# Altium schematic sheet PROC106B_ANALOG_MUX.SchDoc: BREAKAWAY_SECTION4
size 431 x 279 mm; Date: Not shown in title block; ApprovedBy: Not shown in title block; CheckedBy: Not shown in title block; Author: Not shown in title block; CompanyName: Not shown in title block; DrawnBy: Antony/Anand Ram; Engineer: Not shown in title block; Organization: Not shown in title block; Address1: Not shown in title block; Address2: Not shown in title block; Address3: Not shown in title block; Address4: Not shown in title block; DocumentNumber: 10; Revision: Use project parameter SCH_Rev; SheetNumber: 10; SheetTotal: 12; PageSetup: Record=PageOptions|CenterHorizontal=True|CenterVertical=True|PrintScale=1.00|XCorrection=1.00|YCorrection=1.00|PrintKind=0|BorderSize=5000000|LeftOffset=0|BottomOffset=0|Orientation=2|PaperLength=1000|PaperWidth=1000|Scale=100|PaperSource=15|PrintQuality=600|MediaType=1|DitherType=10|PaperKind=Letter|PrintScaleMode=1; CurrentTime: Not shown in title block; CurrentDate: Not shown in title block; Time: Not shown in title block; DocumentFullPathAndName: Not shown in title block; DocumentName: Not shown in title block; ModifiedDate: Not shown in title block; ImagePath: Not shown in title block
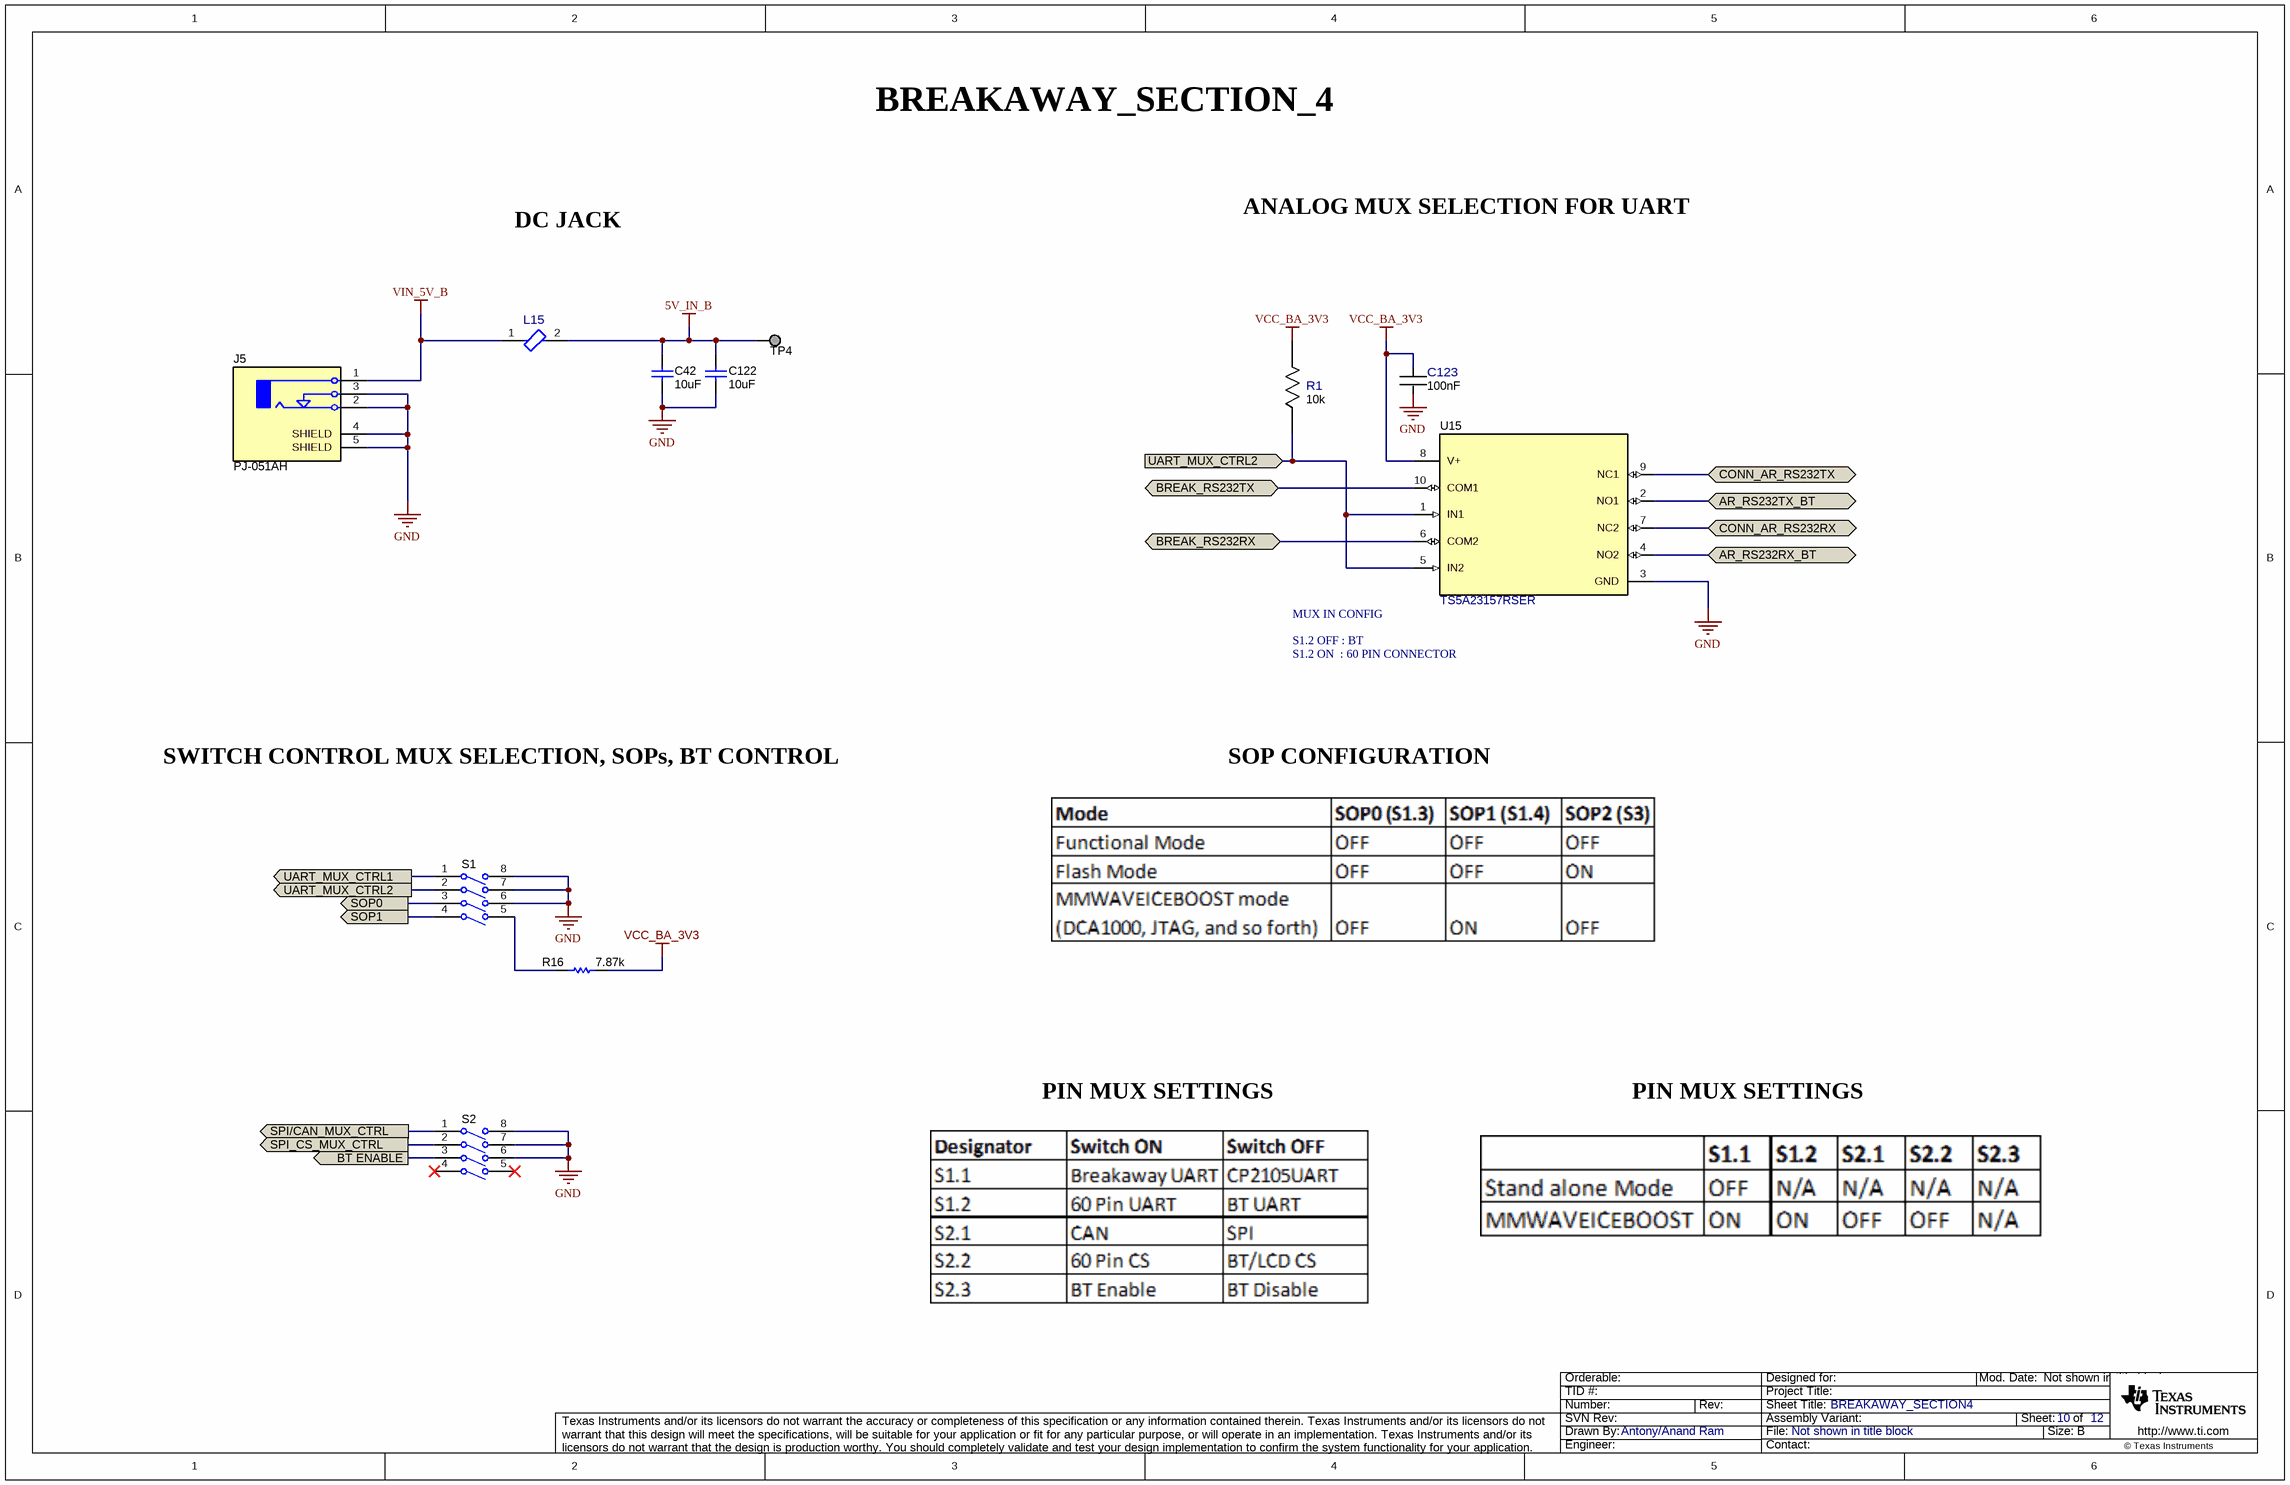
[diagram p0: PROC106B_ANALOG_MUX.SchDoc]

## Parts
C42  value 10uF  [0402_070]  (hidden comment: CL05A106MP5NUNC)
C122  value 10uF  [0402_070]  (hidden comment: CL05A106MP5NUNC)
C123  Cap_F: 100nF  [FP-GRM033R6YA104KE14D_0201 (0603 Metric)-IPC_C]  (hidden comment: GRM033R6YA104KE14D)
J5  PJ-051AH  [CUI_PJ-051AH]
L15  MPZ2012S101ATD25  [FP-MPZ2012S101ATD25_0805-MFG]  (value not drawn)
R1  Res_ohm: 10k  [FP-RR0306P-103-D_0201-IPC_C]  (hidden comment: RR0306P-103-D)
R16  value 7.87k  [0201L]  (hidden comment: RC0201FR-077K87L)
S1  218-4LPST  [SW_218-4LPST]  (value not drawn)
S2  218-4LPST  [SW_218-4LPST]  (value not drawn)
TP4  TESTPOINT  [TP_25MIL-SMT]  (value not drawn)  (no BOM)
U15  TS5A23157RSER  [RSE0010A]

## Ports
AR_RS232RX_BT (bidir), AR_RS232TX_BT (bidir), BREAK_RS232RX (bidir), BREAK_RS232TX (bidir), BT ENABLE (out), CONN_AR_RS232RX (bidir), CONN_AR_RS232TX (bidir), SOP0 (out), SOP1 (out), SPI/CAN_MUX_CTRL (out), SPI_CS_MUX_CTRL (out), UART_MUX_CTRL1 (out), UART_MUX_CTRL2 (in), UART_MUX_CTRL2 (out)

## Nets
5V_IN_B: C42.2 C122.1 L15.2 TP4.1
GND: C42.1 C122.2 C123.2 J5.2(TIP) J5.3(TIP_SWITCH) J5.4(SHIELD) J5.5(SHIELD) S1.6(B3) S1.7(B2) S1.8(B1) S2.6(B3) S2.7(B2) S2.8(B1) U15.3(GND)
VCC_BA_3V3: C123.1 R1.2 R16.1 U15.8(V+)
VIN_5V_B: J5.1(SLEEVE) L15.1
AR_RS232RX_BT: U15.4(NO2) ; port AR_RS232RX_BT
AR_RS232TX_BT: U15.2(NO1) ; port AR_RS232TX_BT
BREAK_RS232RX: U15.6(COM2) ; port BREAK_RS232RX
BREAK_RS232TX: U15.10(COM1) ; port BREAK_RS232TX
BT ENABLE: S2.3(A3) ; port BT ENABLE
CONN_AR_RS232RX: U15.7(NC2) ; port CONN_AR_RS232RX
CONN_AR_RS232TX: U15.9(NC1) ; port CONN_AR_RS232TX
SOP0: S1.3(A3) ; port SOP0
SOP1: S1.4(A4) ; port SOP1
SPI/CAN_MUX_CTRL: S2.1(A1) ; port SPI/CAN_MUX_CTRL
SPI_CS_MUX_CTRL: S2.2(A2) ; port SPI_CS_MUX_CTRL
UART_MUX_CTRL1: S1.1(A1) ; port UART_MUX_CTRL1
UART_MUX_CTRL2: R1.1 S1.2(A2) U15.1(IN1) U15.5(IN2) ; port UART_MUX_CTRL2
NetR16_2: R16.2 S1.5(B4)

Not connected (* = marked no-connect by the designer): S2 4(A4)* 5(B4)*

## Notes on the sheet
- BREAKAWAY_SECTION_4
- DC JACK
- ANALOG MUX SELECTION FOR UART
- MUX IN CONFIG
- S1.2 ON  : 60 PIN CONNECTOR
- S1.2 OFF : BT
- SWITCH CONTROL MUX SELECTION, SOPs, BT CONTROL
- SOP CONFIGURATION
- PIN MUX SETTINGS
- Drawn By:
- SVN Rev:
- Number:
- TID #:
- Orderable:
- Rev:
- Sheet Title:
- File:
- Project Title:
- Designed for:
- Assembly Variant:
- Mod. Date:
- Sheet:
- Size:
- of
- B
- http://www.ti.com
- Texas Instruments and/or its licensors do not warrant the accuracy or completeness of this specification or any information contained therein. Texas Instruments and/or its licensors do not warrant that this design will meet the specifications, will be suitable for your application or fit for any particular purpose, or will operate in an implementation. Texas Instruments and/or its licensors do not warrant that the design is production worthy. You should completely validate and test your design implementation to confirm the system functionality for your application.
- Engineer:
- Contact:
- © Texas Instruments

## Library data of the parts
C42 C122 = CMP-0006339-4: CAP, CERM, 10 uF, 10 V, +/- 20%, X5R, 0402; Manufacturer: Samsung Electro-Mechanics; AEC Category: Q200; AEC Qualified: N; Cap_Case: 0402; Cap_F: 10µF; SizeArea_mm2: 0.5; SizeAreaWB_mm2: 3; SizeX_mm: 1; SizeZ_mm: 0.6; TaMax_C: 85°C; TaMin_C: -55°C; U/M: EA; Value1: Unknown; Value2: 10V; RoHS: Y; AEC Grade: N/A; ComponentLink1Description: Datasheet link; ComponentLink1URL: http://www.samsungsem.com/kr/support/product-search/mlcc/__icsFiles/afieldfile/2018/06/21/CL05A106MP5NUNC.pdf; CompType: Capacitor; MountType: SMT; PackageReference: 0402; PartNumber: CL05A106MP5NUNC; Polarized: N; SizeY_mm: 0.5; Technology: Ceramic; TempCo: X5R; Tolerance_%: 20%; ValueDisplayed: 10uF; VDC_V: 10V
C123 = CMP-0086440-1: Cap Ceramic 0.1uF 35V X5R 10% Pad SMD 0201 85C T/R; Manufacturer: Murata Electronics North America; AEC Qualified: No; SizeZ_mm: 0.33mm; Symbol Name: SYM-GRM033R6YA104KE14D; TempCo: 15%; RoHS: TRUE; ComponentLink1Description: Datasheet; ComponentLink1URL: https://search.murata.co.jp/Ceramy/image/img/A01X/G101/ENG/GRM033R6YA104KE14-01.pdf; PackageReference: 0201 (0603 Metric); PartNumber: GRM033R6YA104KE14D; Tolerance_%: 10%; VDC_V: 35V
J5 = CMP-0081851-1: DC Power Jack, R/A, TH; Manufacturer: CUI Inc.; Gender: Male; Cert_UL: Y; Current_A: 5A; Voltage_V: 24V; ComponentLink1Description: Datasheet URL; RoHS: Y; Supplier 1: Digi-Key; Orientation: R/A; PackageReference: DC Power Jack, R/A, TH; Color: Black; PartNumber: PJ-051AH; PinCount: 3; Supplier Part Number 2: 490-PJ-051AH; Supplier 2: Mouser; ComponentLink1URL: https://www.cui.com/product/resource/pj-051ah.pdf; CompType: Jack; Supplier Part Number 1: CP-051AH-ND; MountType: TH
L15 = CMP-0089947-1: 100 Ohms @ 100MHz 1 Power Line Ferrite Bead 0805 (2012 Metric) 4A 20mOhm; Manufacturer: TDK; DCR_ohm: 0.02; SizeZ_mm: 1.05mm; AEC Grade: Grade 1; AEC Qualified: Yes; Impedance At Frequency: 100Ω @ 100MHz; Tolerance_%: 25%; ComponentLink1URL: https://product.tdk.com/info/en/catalog/datasheets/beads_automotive_power_mpz2012_en.pdf; Supplier Part Number 2: 810-MPZ2012S101ATD25; Supplier 2: Mouser; RoHS: TRUE; Supplier 1: Digikey; PackageReference: 0805; Imax_A: 4A; PartNumber: MPZ2012S101ATD25; ComponentLink1Description: Datasheet; Supplier Part Number 1: 445-172903-1-ND; datasheet: https://product.tdk.com/info/en/catalog/datasheets/beads_automotive_power_mpz2012_en.pdf; Datasheet Path: datasheets/FBead-MPZ2012S101ATD25.pdf; Digikey Description: FERRITE BEAD 100 OHM 0805 1LN; Digikey Part Number: 445-172903-1-ND; helpURL: https://upverter.com/upn/revision/572b4800072287ce/; Lead Free: Yes; Material: Ferrite; Mouser Description: Ferrite Beads 0805 100ohms@100MHz 4.0A AEC-Q200; Mouser Part Number: 810-MPZ2012S101ATD25; Operating Temperature Range: -55°C to +125°C; Part Number: MPZ2012S101ATD25; Test Frequency: 100MHz
R1 = CMP-0088002-1: 10 kOhms ±0.5% 0.05W, 1/20W Chip Resistor 0201 (0603 Metric)  Thin Film; Manufacturer: Susumu; AEC Qualified: No; Power_W: 50mW; SizeZ_mm: 0.26mm; Symbol Name: SYM-RR0306P-103-D; TempCo: 25ppm/°C; VDC_V: 15V; RoHS: TRUE; ComponentLink1Description: Datasheet; ComponentLink1URL: https://www.susumu.co.jp/common/pdf/n_catalog_partition05_en.pdf; PackageReference: 0201; PartNumber: RR0306P-103-D; Technology: Thin Film; Tolerance_%: 0.5%
R16 = CMP-0027880-1: RES, 7.87 k, 1%, 0.05 W, 0201; Manufacturer: Yageo America; AEC Category: Q200; AEC Qualified: N; EIA_Code: E96; Power_W: 50mW; SizeArea_mm2: 0.18; SizeX_mm: 0.6; SizeY_mm: 0.3; SizeZ_mm: 0.26; TempCo: 200 ppm/C; U/M: EA; Value2: 0.05W; Value_Code: 7k87; VDC_V: 25V; RoHS: Y; AEC Grade: N/A; ComponentLink1Description: Datasheet link; ComponentLink1URL: http://www.yageo.com/documents/recent/PYu-RC_Group_51_RoHS_L_5.pdf; CompType: Resistor; LatestRevisionDate: 2017-03-09; MountType: SMT; PackageReference: 0201; PartNumber: RC0201FR-077K87L; Published: 2016-10-14; Publisher: Texas Instruments; Res_ohm: 7.87k; Supplier 1: Digi-Key; Supplier 2: Mouser; Supplier Part Number 1: YAG2807CT-ND; Supplier Part Number 2: 603-RC0201FR-077K87L; Technology: Thick Film; Tolerance_%: 1%; Value1: 1%; ValueDisplayed: 7.87k
S1 S2 = CMP-0002128-2: Switch, Slide, SPST 4 poles, SMT; Manufacturer: CTS Electrocomponents; CurrentRating_mA: 25A; PositionCount: 4; VDC_V: 24V; SwitchFunction: Off-On; Supplier 2: Mouser; Supplier 1: Digi-Key; Supplier Part Number 1: CT2184LPST-ND; Supplier Part Number 2: 774-2184LPST; PartNumber: 218-4LPST; ComponentLink1Description: Datasheet URL; LatestRevisionDate: 2017-03-09; ComponentLink1URL: http://www.ctscorp.com/components/Datasheets/218.pdf; CompType: Switch; PackageReference: SW, SMT Half Pitch 4SPST, 5.8x2.7x6.25 mm; Publisher: Texas Instruments; Circuit: SPST; RoHS: Y; Orientation: Horizontal; MountType: SMT
TP4 = CMP-0078143-3: TEST POINT.  No entry in BOM.; CompType: Testpoint; Manufacturer: N/A; PackageReference: N/A; PartNumber: N/A; Library Reference: TESTPOINT
U15 = CMP-0074545-1: Dual 10-ohm SPDT Analog Switch, RSE0010A (UQFN-10); Alternate Manufacturer: Texas Instruments; CompType: IC; SizeArea_mm2: 3.0; SizeAreaWB_mm2: 7.5; SizeX_mm: 1.5; SizeY_mm: 2.0; SizeZ_mm: 0.6; U/M: EA; RoHS: Y; ComponentLink1Description: Datasheet Link; ComponentLink1URL: http://www.ti.com/lit/ds/symlink/ts5a23157.pdf; Footprint Path 6: C:\AltiumLibraries\Footprints\TI\.PcbLib; LatestRevisionDate: 2017-06-09; Manufacturer: Texas Instruments; MountType: SMT; PackageDescription: UQFN-10; PackageReference: RSE0010A; PartNumber: TS5A23157RSER; Publisher: Texas Instruments